# EAGLE design 612_jetracer_328_020017 (EAGLE 9.6.2)
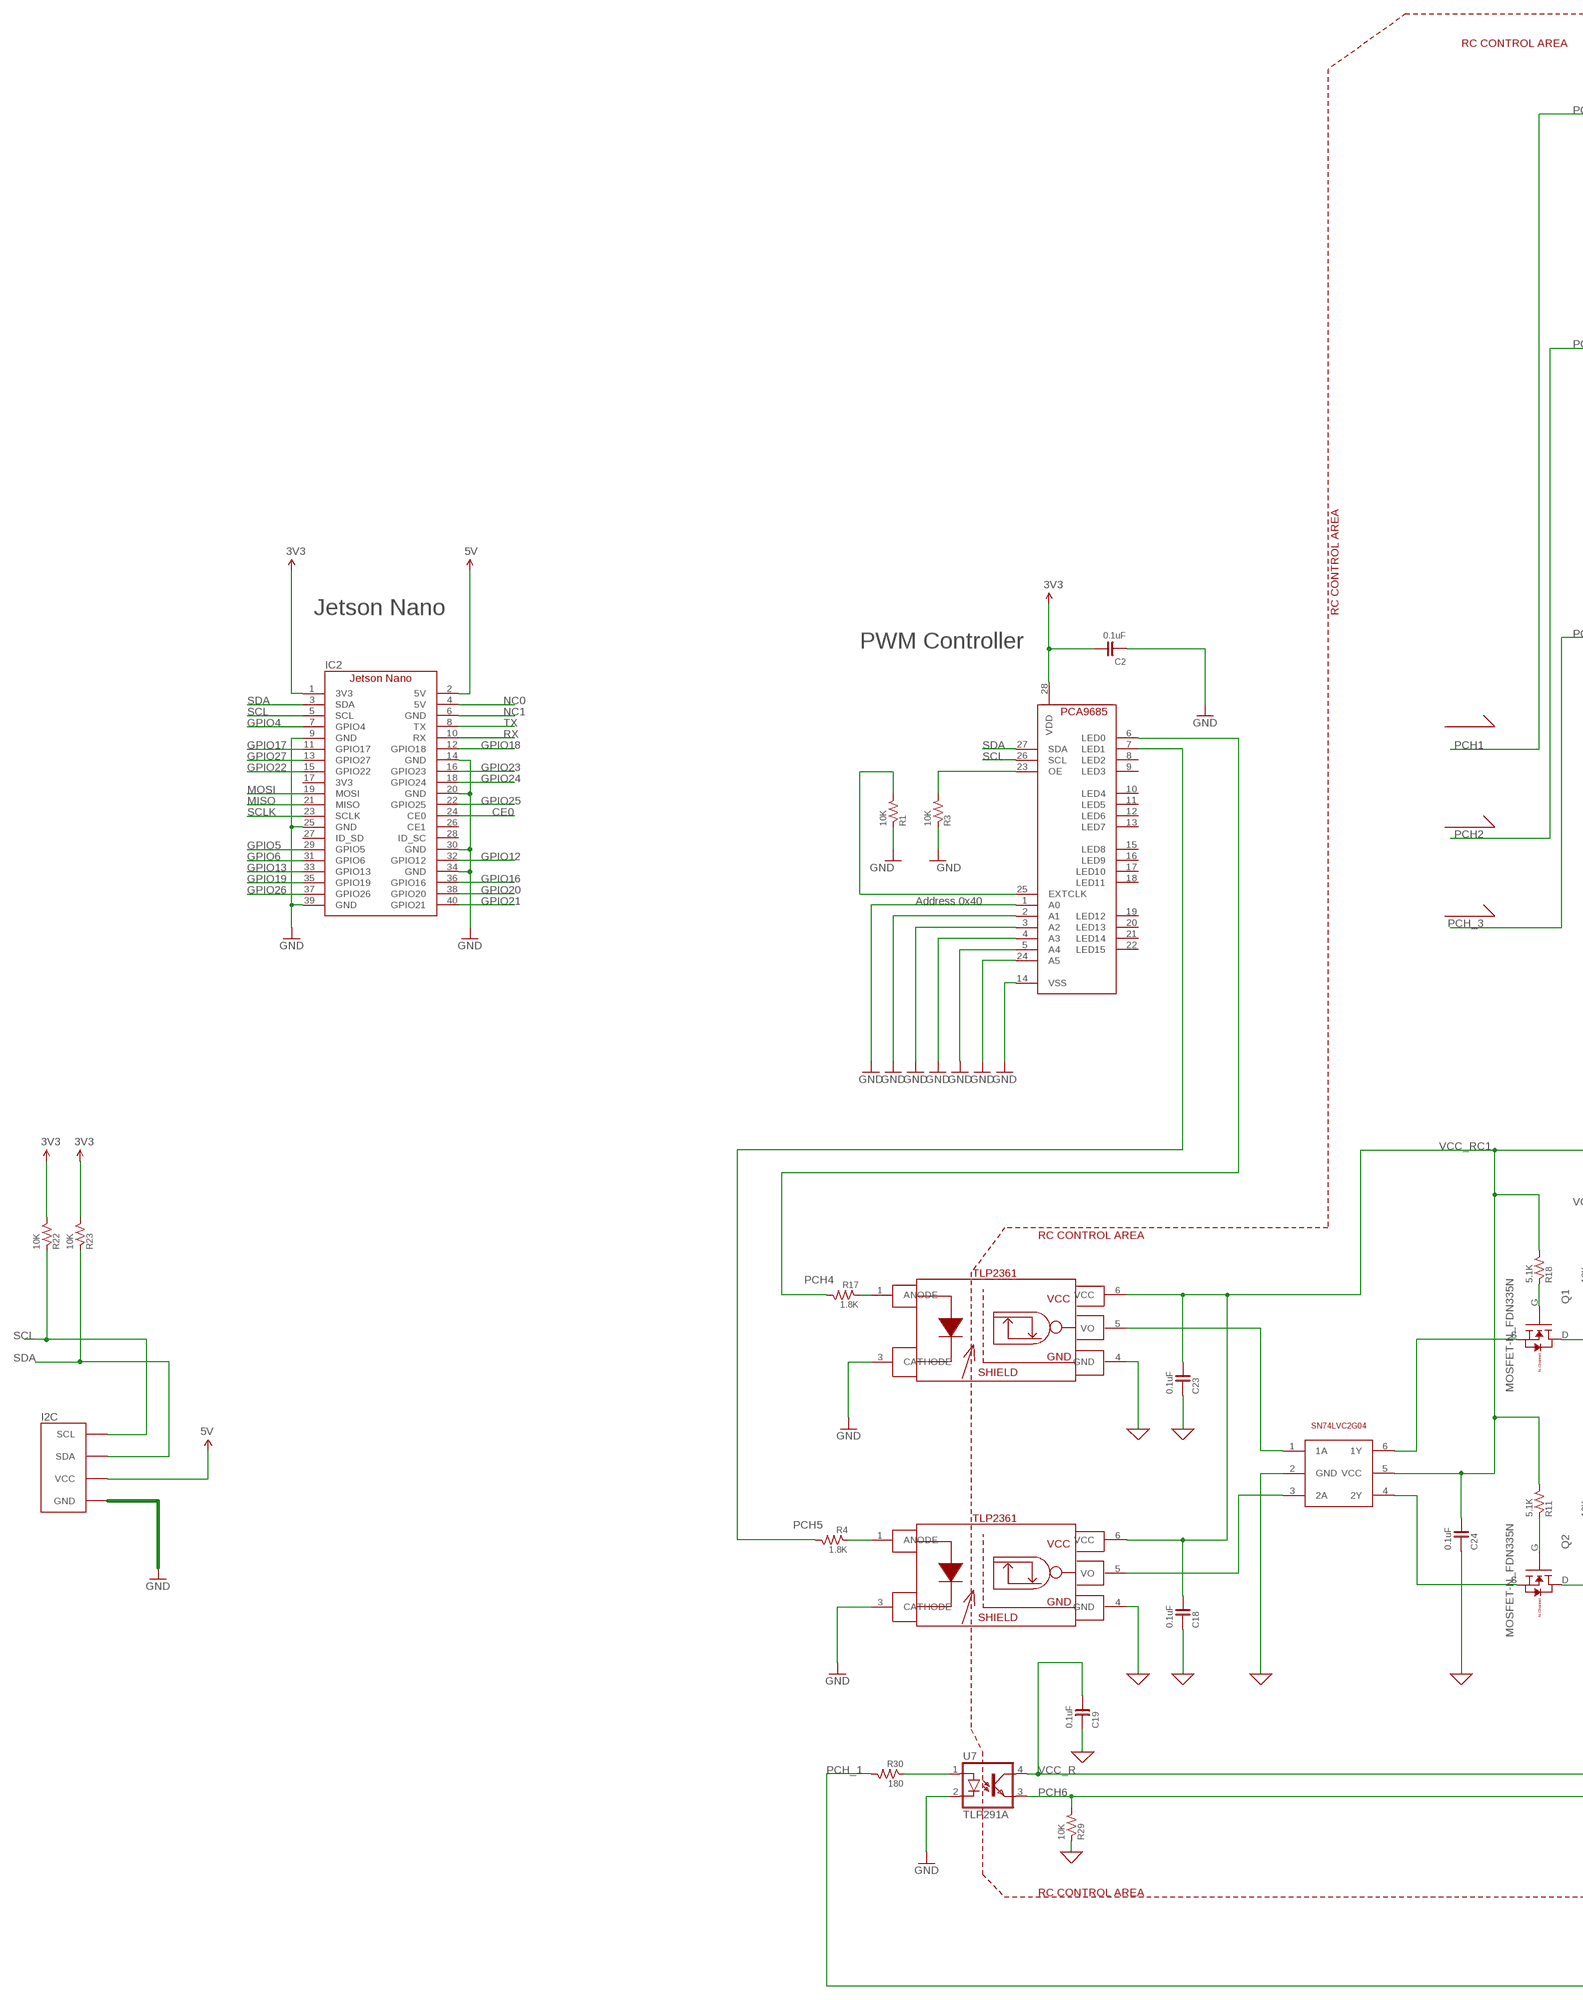
[diagram p0: schematic, sheet 1, part 1 of 3]
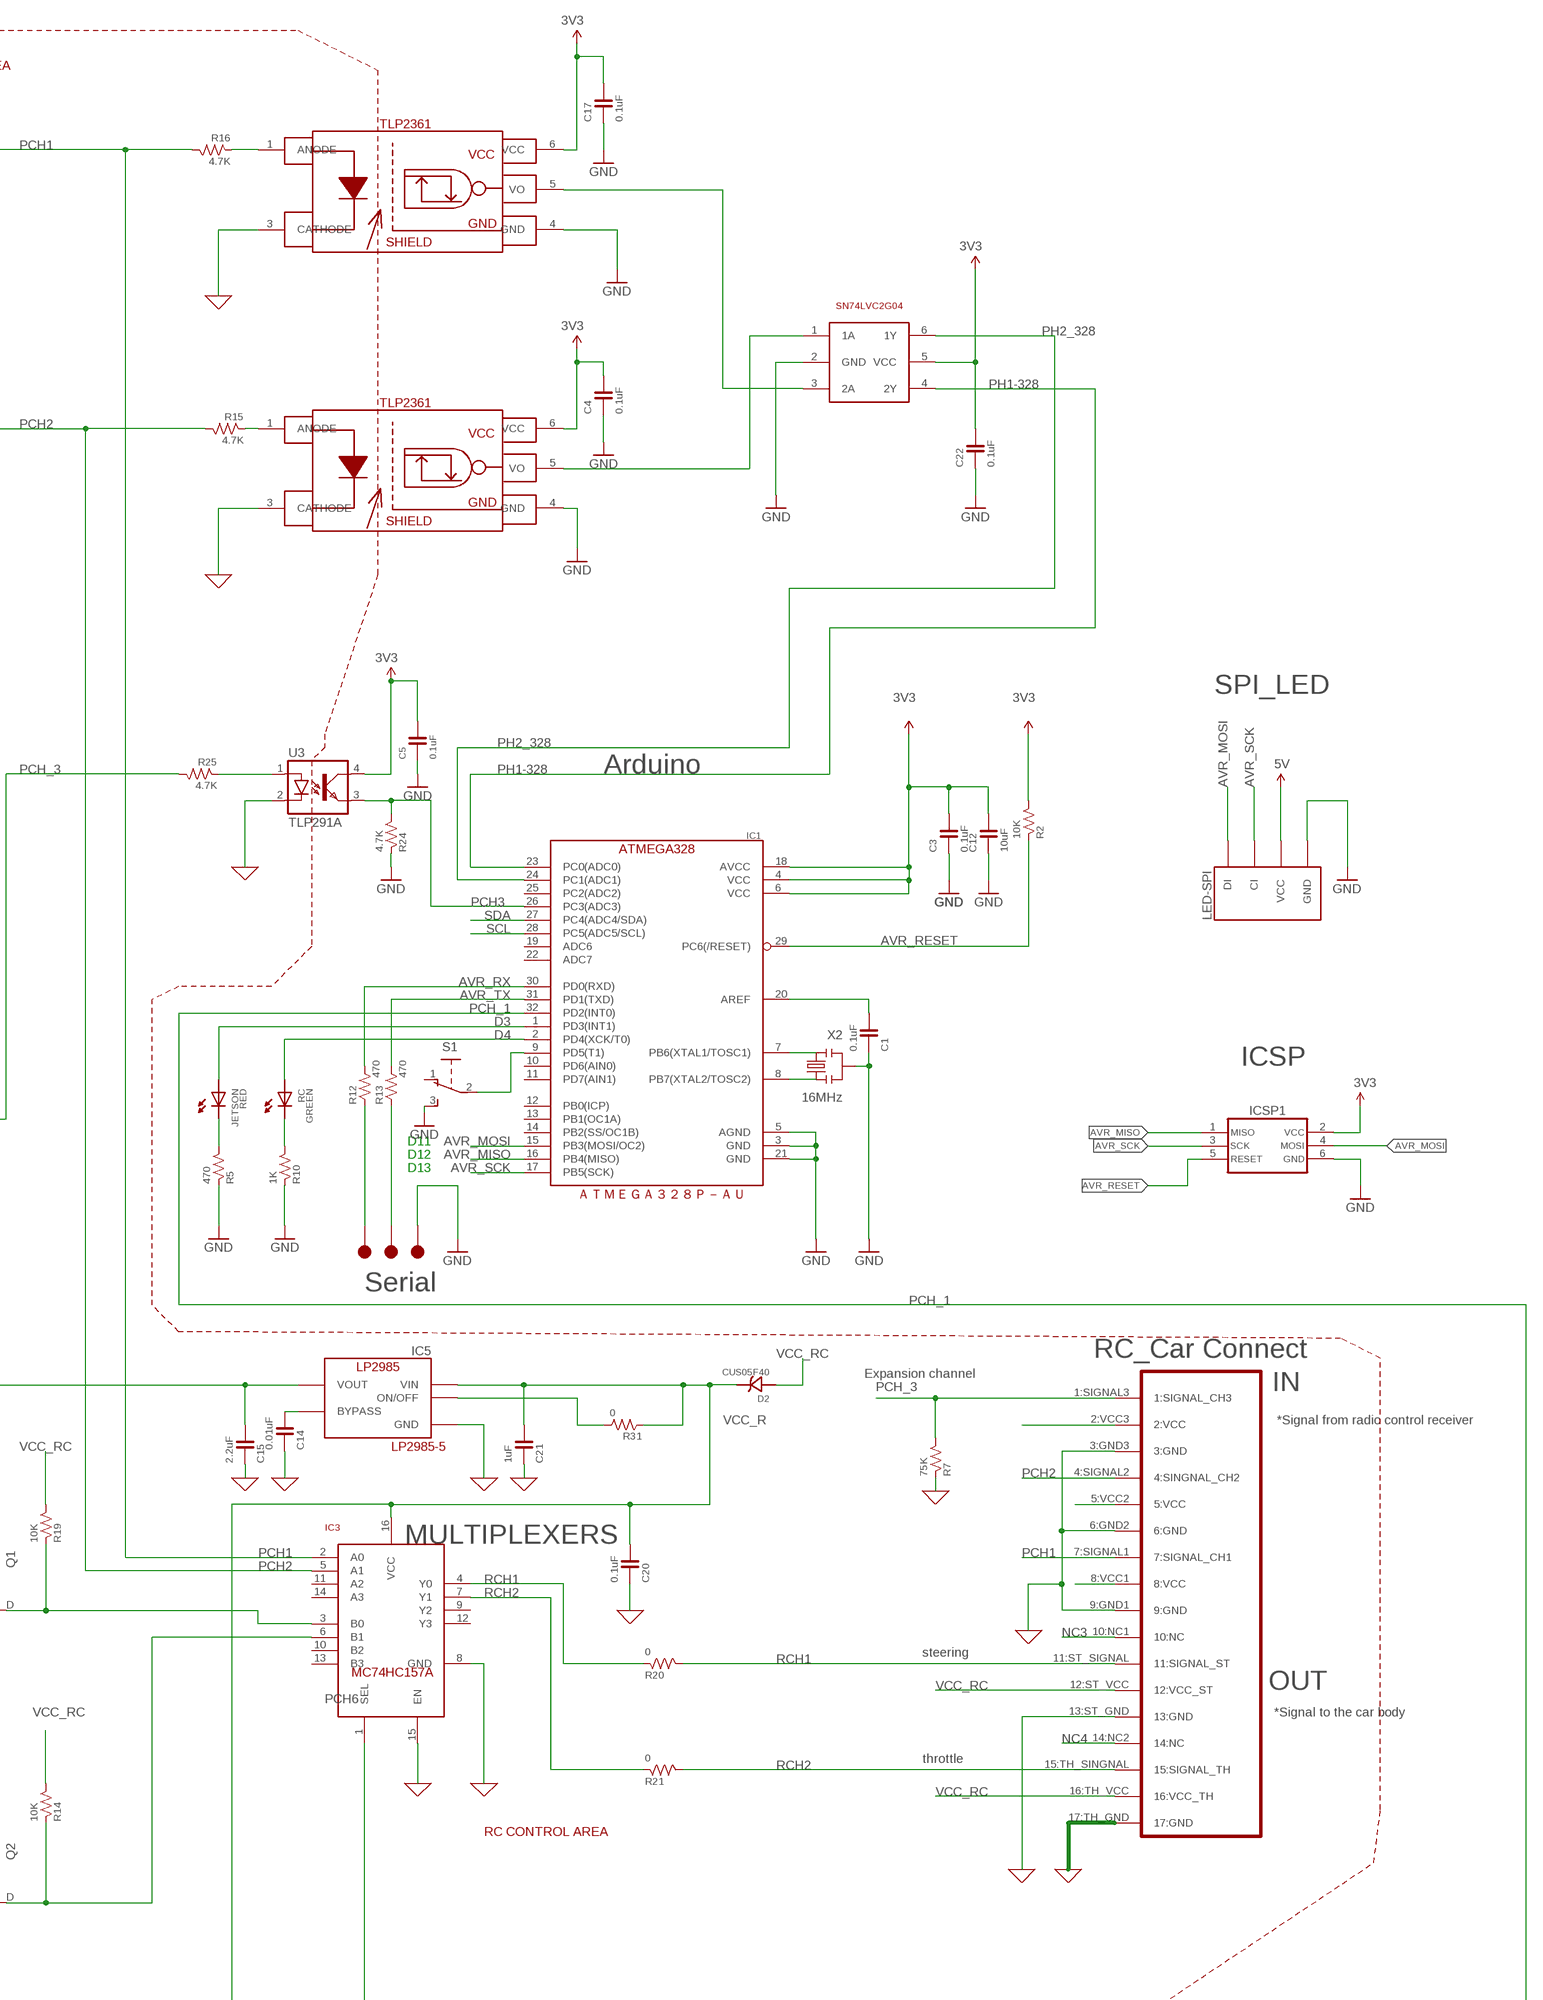
[diagram p1: schematic, sheet 1, part 2 of 3]
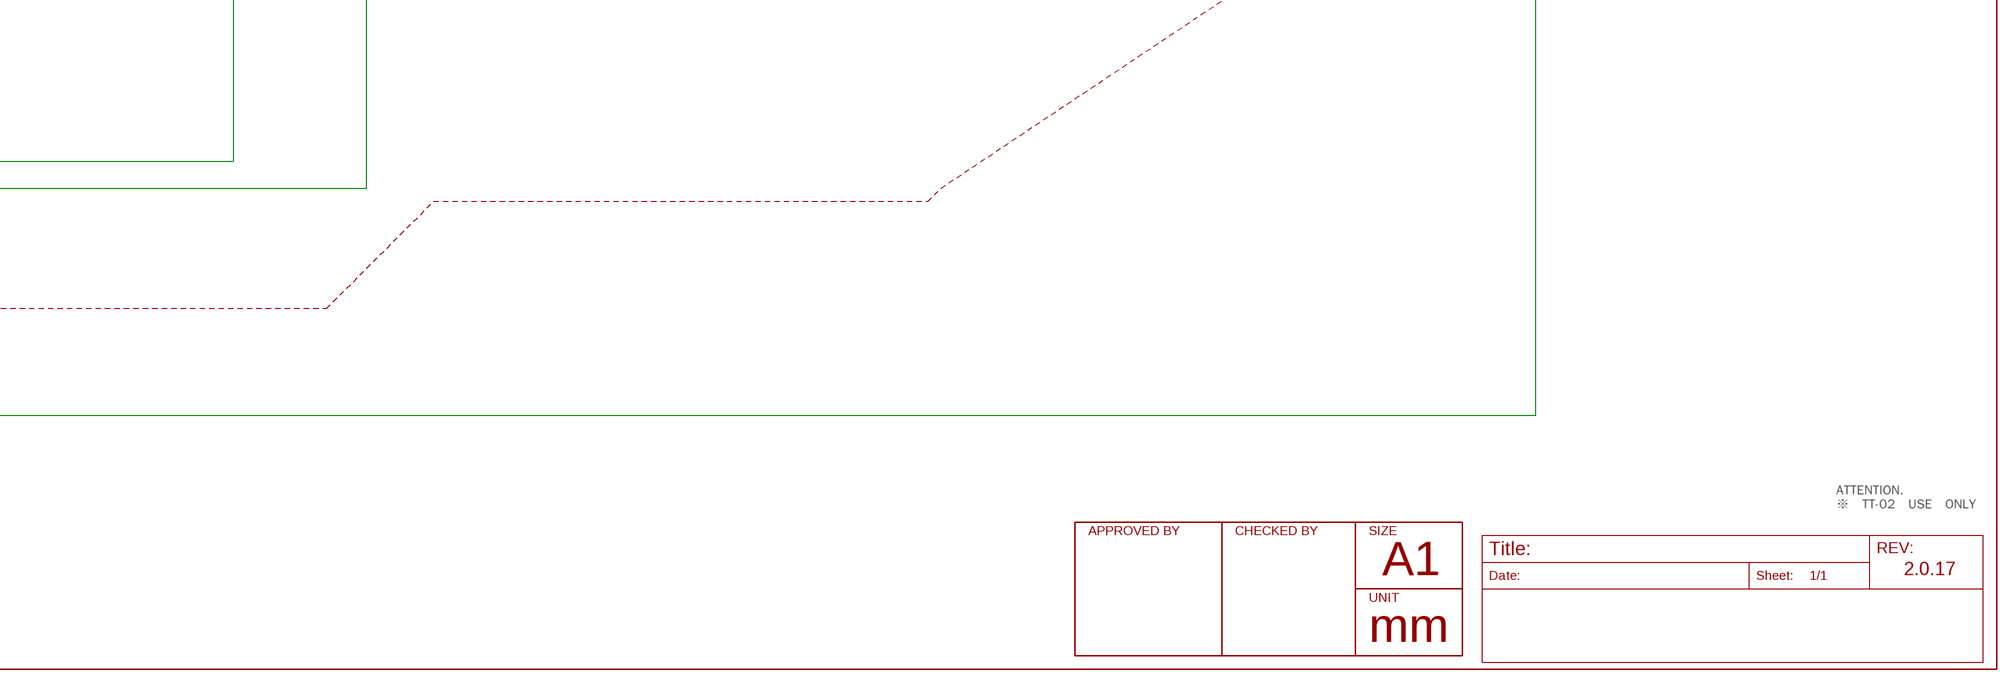
[diagram p2: schematic, sheet 1, part 3 of 3]

## Parts
C1  0.1uF  CAPACITOR-0603  [0603]
C2  0.1uF  CAPACITOR-0603  [0603]
C3  0.1uF  CAPACITOR-0402  [0402]
C4  0.1uF  CAPACITOR-0402  [0402]
C5  0.1uF  CAPACITOR-0603  [0603]
C12  10uF  CAPACITOR-0402  [0402]
C14  0.01uF  CAPACITOR-0603  [0603]
C15  2.2uF  CAPACITOR-0603  [0603]
C17  0.1uF  CAPACITOR-0603  [0603]
C18  0.1uF  CAPACITOR-0603  [0603]
C19  0.1uF  CAPACITOR-0603  [0603]
C20  0.1uF  CAPACITOR-0603  [0603]
C21  1uF  CAPACITOR-0603  [0603]
C22  0.1uF  CAPACITOR-0402  [0402]
C23  0.1uF  CAPACITOR-0603  [0603]
C24  0.1uF  CAPACITOR-0603  [0603]
D2  CUS05F40  [CUS05F40]
I2C  FABO-I2C_BM04B  [I2C-BM04B-PASS-1]
IC1  ATMEGA328P-AU  [TQFP-32]
IC2  JETSON_NANO_NOBORDER  [JETSON_NANO_NOBOARDER]
IC3  MULTIPLEXERSMC74HC157A  [TSSOP-16]
IC4  PCA9685_BOTTOM  [PCA9685_BOTTOM]
IC5  LP2985-33DBV  [SOT-23-5]
ICSP1  ICSP_AVR-TC_NOHOLE  [TC2030]
JETSON  GREEN  LED-0603  [0603]
LED-SPI  FABO-SPI-LED-BM04B  [SPI-BM04B-PASS-1]
Q1  MOSFET-N_FDN335N  [SUPERSOT-3]
Q2  MOSFET-N_FDN335N  [SUPERSOT-3]
R1  10K  RESISTOR-0603  [0603]
R2  10K  RESISTOR-0603  [0603]
R3  10K  RESISTOR-0603  [0603]
R4  1.8K  RESISTOR-0603  [0603]
R5  470  RESISTOR-0603  [0603]
R7  75K  RESISTOR-0603  [0603]
R10  1K  RESISTOR-0603  [0603]
R11  5.1K  RESISTOR-0603  [0603]
R12  470  RESISTOR-0603  [0603]
R13  470  RESISTOR-0603  [0603]
R14  10K  RESISTOR-0603  [0603]
R15  4.7K  RESISTOR-0603  [0603]
R16  4.7K  RESISTOR-0603  [0603]
R17  1.8K  RESISTOR-0603  [0603]
R18  5.1K  RESISTOR-0603  [0603]
R19  10K  RESISTOR-0603  [0603]
R20  0  RESISTOR-0603  [0603]
R21  0  RESISTOR-0603  [0603]
R22  10K  RESISTOR-0603  [0603]
R23  10K  RESISTOR-0603  [0603]
R24  4.7K  RESISTOR-0603  [0603]
R25  4.7K  RESISTOR-0603  [0603]
R29  10K  RESISTOR-0603  [0603]
R30  180  RESISTOR-0603  [0603]
R31  0  RESISTOR-0603  [0603]
RC  RED  LED-0603  [0603]
S1  SLIDE-SSSS810701  [SSSS810701]
T5  SN74LVC2G04  [SOT-23-6]
T6  SN74LVC2G04  [SOT-23-6]
TP1  TP-15  [TP-15]
TP2  TP-15  [TP-15]
TP3  TP-15  [TP-15]
U3  TLP291A  [11-3C1]
U7  TLP291A  [11-3C1]
U8  TLP2361  [TLP2361]
U9  TLP2361  [TLP2361]
U10  TLP2361  [TLP2361]
U11  TLP2361  [TLP2361]
U$1  RC_17PIN_OUTIN  [PNHEADER_2.54_SMT_17PIN_RC_TT01_02]
X2  16MHz  RESONATOR  [CSTNE_V_C]

## Nets
0: C14.1 C15.1 C18.1 C19.1 C20.1 C21.1 C23.1 C24.1 IC3.8(GND) IC3.15(EN) IC5.2(GND) R7.1 R29.1 T6.2(GND) U3.2(C) U8.3(CATHODE) U9.3(CATHODE) U10.4(GND) U11.4(GND) U$1.3:GND3(3:GND) U$1.6:GND2(6:GND) U$1.9:GND1(9:GND) U$1.13:ST_GND(13:GND) U$1.17:TH_GND(17:GND) ; supply symbol labelled GND
3V3: C2.2 C3.2 C4.2 C5.2 C12.2 C17.2 C22.2 IC1.4(VCC) IC1.6(VCC) IC1.18(AVCC) IC2.1(3V3) IC4.28(VDD) ICSP1.2 R2.2 R22.2 R23.2 T5.5(VCC) U3.4(COL) U8.6(VCC) U9.6(VCC)
5V: I2C.5V(VCC) IC2.2(5V) LED-SPI.5V(VCC)
AVR_MISO: IC1.16(PB4(MISO)) ICSP1.1
AVR_MOSI: IC1.15(PB3(MOSI/OC2)) ICSP1.4 LED-SPI.DI
AVR_RESET: IC1.29(PC6(/RESET)) ICSP1.5 R2.1
AVR_RX: IC1.30(PD0(RXD)) R12.2
AVR_SCK: IC1.17(PB5(SCK)) ICSP1.3 LED-SPI.CI
AVR_TX: IC1.31(PD1(TXD)) R13.2
CE0: IC2.24(CE0)
D3: IC1.1(PD3(INT1)) RC.ANODE
D4: IC1.2(PD4(XCK/T0)) JETSON.ANODE
GND: C1.1 C2.1 C3.1 C4.1 C5.1 C12.1 C17.1 C22.1 I2C.GND IC1.3(GND) IC1.5(AGND) IC1.21(GND) IC2.9(GND) IC2.14(GND) IC2.20(GND) IC2.25(GND) IC2.30(GND) IC2.34(GND) IC2.39(GND) IC4.1(A0) IC4.2(A1) IC4.3(A2) IC4.4(A3) IC4.5(A4) IC4.14(VSS) IC4.24(A5) ICSP1.6 LED-SPI.GND R1.1 R3.1 R5.1 R10.1 R24.1 S1.3 T5.2(GND) TP3.1 U7.2(C) U8.4(GND) U9.4(GND) U10.3(CATHODE) U11.3(CATHODE) X2.2
GPIO4: IC2.7(GPIO4)
GPIO5: IC2.29(GPIO5)
GPIO6: IC2.31(GPIO6)
GPIO12: IC2.32(GPIO12)
GPIO13: IC2.33(GPIO13)
GPIO16: IC2.36(GPIO16)
GPIO17: IC2.11(GPIO17)
GPIO18: IC2.12(GPIO18)
GPIO19: IC2.35(GPIO19)
GPIO20: IC2.38(GPIO20)
GPIO21: IC2.40(GPIO21)
GPIO22: IC2.15(GPIO22)
GPIO23: IC2.16(GPIO23)
GPIO24: IC2.18(GPIO24)
GPIO25: IC2.22(GPIO25)
GPIO26: IC2.37(GPIO26)
GPIO27: IC2.13(GPIO27)
MISO: IC2.21(MISO)
MOSI: IC2.19(MOSI)
N$2: R4.1 U11.1(ANODE)
N$3: IC3.3(B0) Q1.D R19.1
N$4: C1.2 IC1.20(AREF)
N$5: IC1.8(PB7(XTAL2/TOSC2)) X2.3
N$6: R12.1 TP1.1
N$7: IC4.23(OE) R3.2
N$8: IC4.25(EXTCLK) R1.2
N$9: R15.1 U9.1(ANODE)
N$10: T5.1(1A) U9.5(VO)
N$11: T5.3(2A) U8.5(VO)
N$12: R16.1 U8.1(ANODE)
N$13: R17.1 U10.1(ANODE)
N$14: T6.1(1A) U10.5(VO)
N$15: IC1.7(PB6(XTAL1/TOSC1)) X2.1
N$16: IC1.9(PD5(T1)) S1.2
N$17: R13.1 TP2.1
N$18: T6.3(2A) U11.5(VO)
N$19: R5.2 RC.CATHODE
N$20: JETSON.CATHODE R10.2
N$31: C14.2 IC5.4(BYPASS)
N$32: IC5.3(ON/OFF) R31.2
N$34: Q2.S T6.4(2Y)
N$35: R21.2 U$1.15:TH_SINGNAL(15:SIGNAL_TH)
N$36: R20.2 U$1.11:ST_SIGNAL(11:SIGNAL_ST)
N$37: Q1.S T6.6(1Y)
N$38: R25.1 U3.1(A)
N$39: Q2.G R11.1
N$40: Q1.G R18.1
N$42: IC3.6(B1) Q2.D R14.1
N$43: R30.1 U7.1(A)
NC0: IC2.4(5V)
NC1: IC2.6(GND)
NC3: U$1.10:NC1(10:NC)
NC4: U$1.14:NC2(14:NC)
PCH1: IC3.2(A0) R16.2 U$1.7:SIGNAL1(7:SIGNAL_CH1)
PCH2: IC3.5(A1) R15.2 U$1.4:SIGNAL2(4:SINGNAL_CH2)
PCH3: IC1.26(PC3(ADC3)) R24.2 U3.3(EMI)
PCH4: IC4.6(LED0) R17.2
PCH5: IC4.7(LED1) R4.2
PCH6: IC3.1(SEL) R29.2 U7.3(EMI)
PCH_1: IC1.32(PD2(INT0)) R30.2
PCH_3: R7.2 R25.2 U$1.1:SIGNAL3(1:SIGNAL_CH3)
PH1-328: IC1.23(PC0(ADC0)) T5.4(2Y)
PH2_328: IC1.24(PC1(ADC1)) T5.6(1Y)
RCH1: IC3.4(Y0) R20.1
RCH2: IC3.7(Y1) R21.1
RX: IC2.10(RX)
SCL: I2C.SCL IC1.28(PC5(ADC5/SCL)) IC2.5(SCL) IC4.26(SCL) R22.1
SCLK: IC2.23(SCLK)
SDA: I2C.SDA IC1.27(PC4(ADC4/SDA)) IC2.3(SDA) IC4.27(SDA) R23.1
TX: IC2.8(TX)
VCC_R: C19.2 C20.2 C21.2 D2.C(CATHODE) IC3.16(VCC) IC5.1(VIN) R31.1 U7.4(COL)
VCC_RC: D2.A(ANODE) R14.2 R19.2 U$1.2:VCC3(2:VCC) U$1.5:VCC2(5:VCC) U$1.8:VCC1(8:VCC) U$1.12:ST_VCC(12:VCC_ST) U$1.16:TH_VCC(16:VCC_TH)
VCC_RC1: C15.2 C18.2 C23.2 C24.2 IC5.5(VOUT) R11.2 R18.2 T6.5(VCC) U10.6(VCC) U11.6(VCC)
Unconnected: IC1.10(PD6(AIN0)) IC1.11(PD7(AIN1)) IC1.12(PB0(ICP)) IC1.13(PB1(OC1A)) IC1.14(PB2(SS/OC1B)) IC1.19(ADC6) IC1.22(ADC7) IC1.25(PC2(ADC2)) IC2.17(3V3) IC2.26(CE1) IC2.27(ID_SD) IC2.28(ID_SC) IC3.9(Y2) IC3.10(B2) IC3.11(A2) IC3.12(Y3) IC3.13(B3) IC3.14(A3) IC4.8(LED2) IC4.9(LED3) IC4.10(LED4) IC4.11(LED5) IC4.12(LED6) IC4.13(LED7) IC4.15(LED8) IC4.16(LED9) IC4.17(LED10) IC4.18(LED11) IC4.19(LED12) IC4.20(LED13) IC4.21(LED14) IC4.22(LED15) S1.1

## Notes on the sheet
- RC CONTROL AREA
- SPI_LED
- Jetson Nano | RC CONTROL AREA
- Arduino
- PWM Controller
- ICSP
- Address 0x40
- D11
- D12
- D13
- ＡＴＭＥＧＡ３２８Ｐ－ＡＵ
- Serial
- RC_Car Connect
- Expansion channel
- IN
- *Signal from radio control receiver
- LP2985-5
- RC CONTROL AREA
- MULTIPLEXERS
- steering
- MC74HC157A
- OUT
- *Signal to the car body
- throttle
- RC CONTROL AREA
- RC CONTROL AREA
- ATTENTION.
  ※　TT-02　USE　ONLY
- 2.0.17

## Library data of the parts
C1-C5 C12 C14 C15 C17 C20-C22 = FaBo-Capacitor:CAPACITOR: CAPACITOR
C18 C19 C23 C24 = FaBo-Capacitor:CAPACITOR: CAPACITOR; SPICEPREFIX: C
D2 = FaBo-Diode:CUS05F40
I2C = FaBo-Connetor:FABO-I2C
IC1 = component:ATMEGA328
IC2 = FaBo-Boards:JETSON_NANO
IC3 = FaBo-Multiplexers:MULTIPLEXERS
IC4 = FaBo-Motor:PCA9685
IC5 = FaBo-Supply:LP2985: LP2985
ICSP1 = component:ICSP_AVR
JETSON RC = FaBo-LED:LED
LED-SPI = FaBo-Connetor:FABO-SPI-LED
Q1 Q2 = FaBo-Mosfet:MOSFET-N
R1-R5 R7 R10-R25 R29-R31 = FaBo-Resistors:RESISTOR: RESISTOR
S1 = FaBo-Switch:SLIDE
T5 T6 = FaBo-Transistor:SN74LVC2G04
TP1-TP3 = FaBo-Supply:TP
U3 U7 = FaBo_Photocoupler:TLP291A
U8-U11 = FaBo-etc:TLP2361
U$1 = FaBo-PIN:RC_17PIN_OUTIN
X2 = component:RESONATOR

## Board
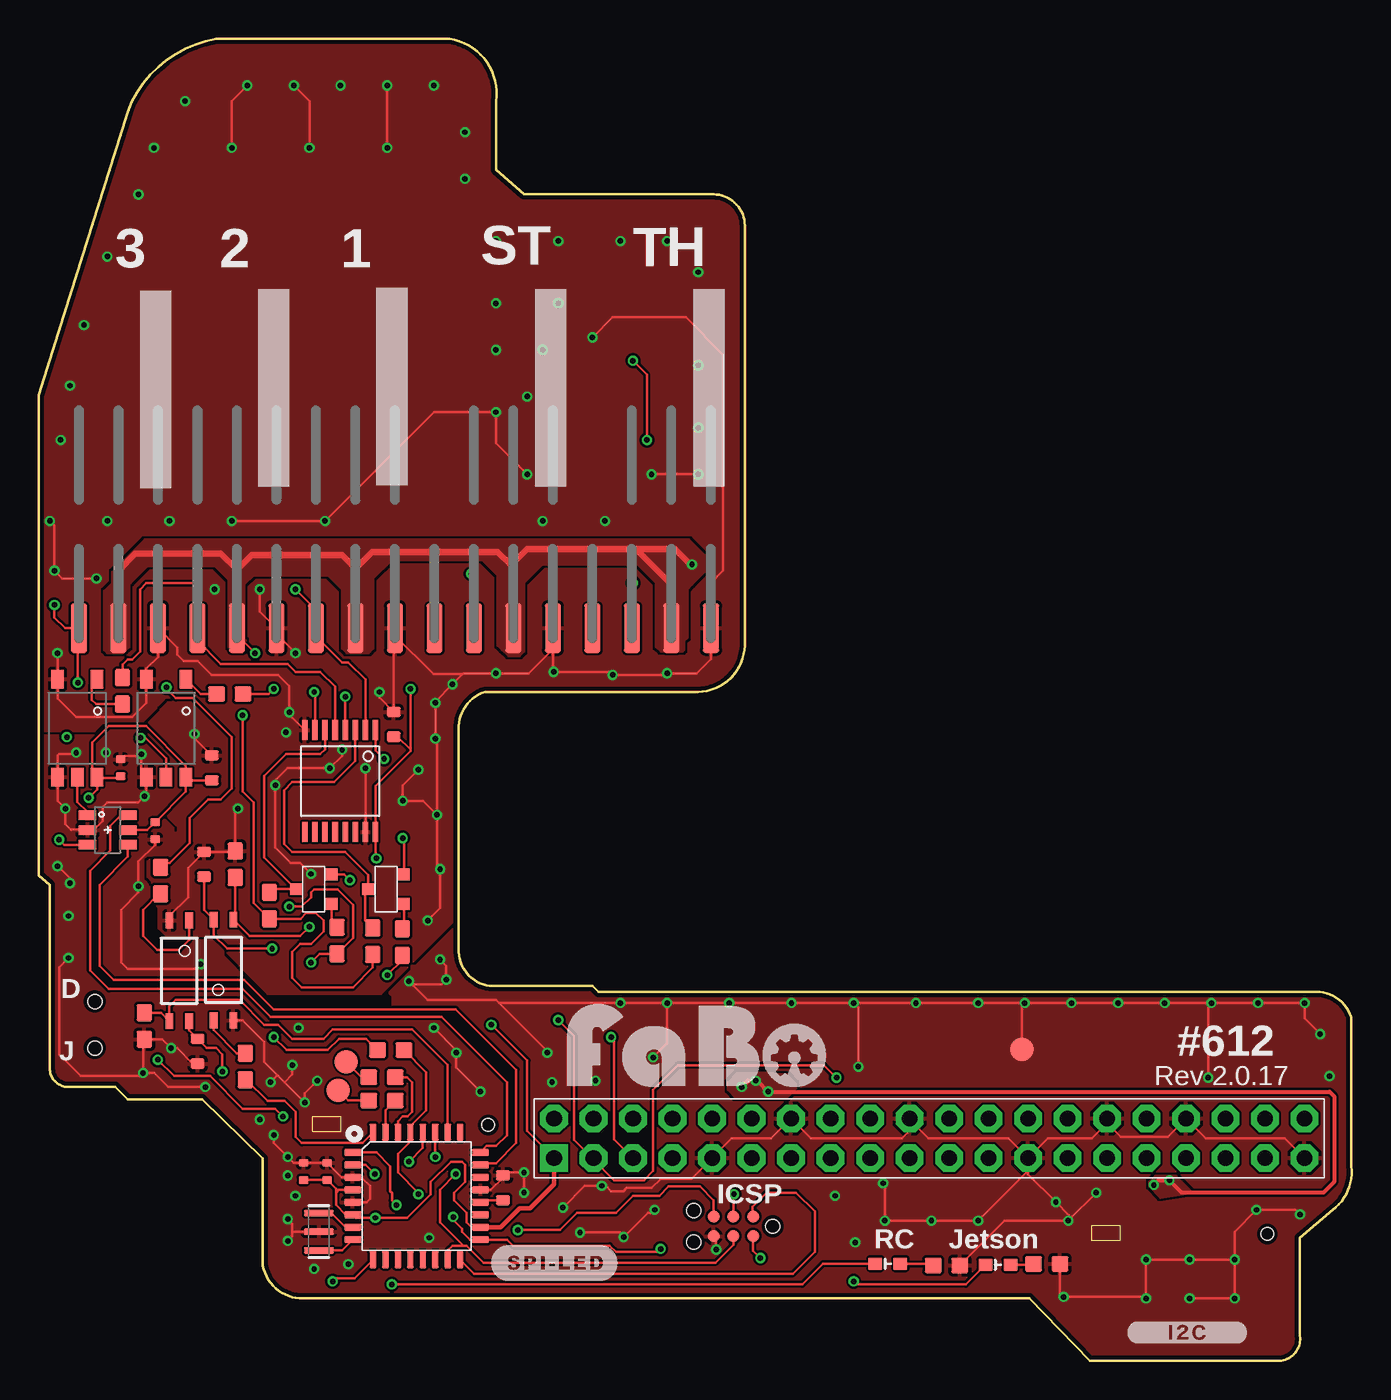
[diagram p3: board, top side]
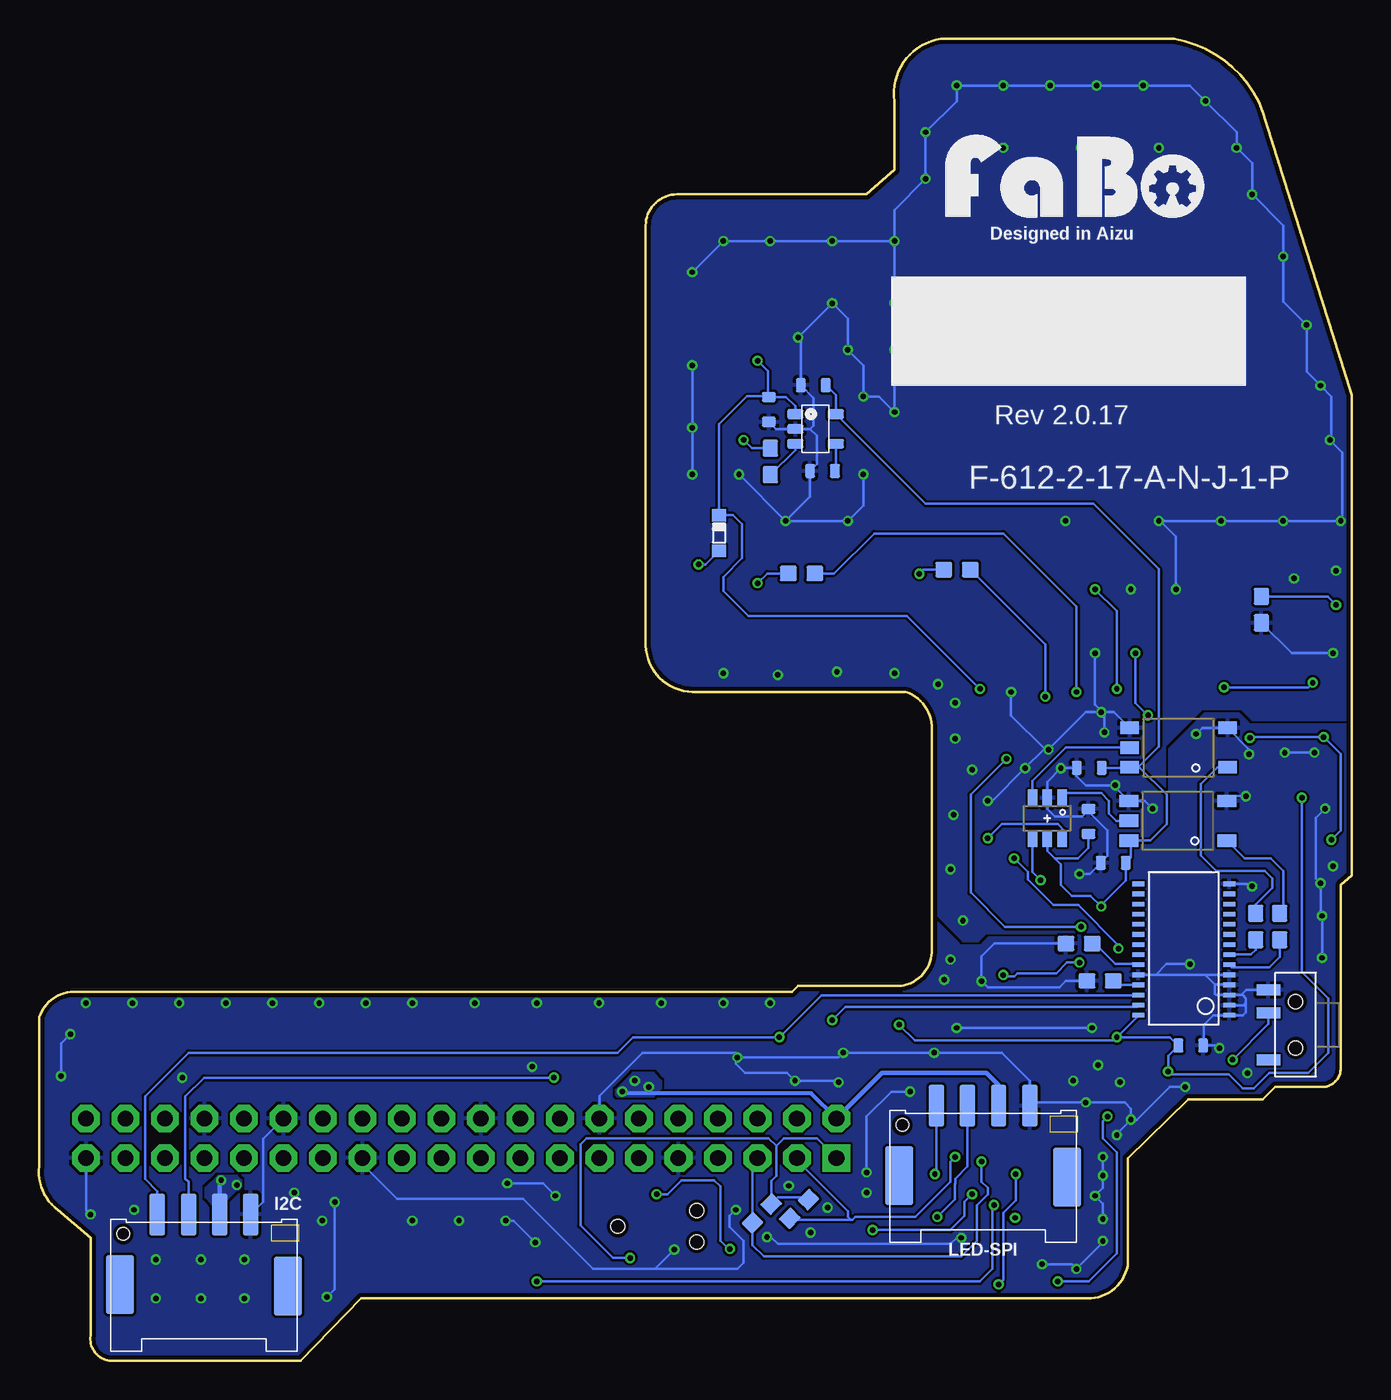
[diagram p4: board, bottom side, seen from below]

Size 84.42 x 85 mm. Coordinates in mm from the lower left corner, seen from the top.
Outline: 0,31.2 0,62.1 5.7,80.3 arc-60 11.4,85 26.4,85 arc-90 29.4,81 29.4,76.6 31.2,75 43.4,75 arc-90 45.4,73 45.4,46 arc-86 42.4,43 28.7,43 arc71 27,40.8 27,26.5 arc85 29,24.1 35.6,24.1 36,23.7 81.9,23.7 arc-78 84.4,22.1 84.4,12.5 arc-61 83.2,9.7 81.1,7.9 81.1,1.6 arc-90 79.9,0 67.6,0 63.7,4 17,4 arc-80 14.4,6.1 14.4,13 10.5,16.8 5.7,16.8 4.9,17.6 1.9,17.6 arc-85 0.7,18.7 0.7,30.6 0,31.2
Copper layers (1*16): Top 0.035mm / dielectric 1.6mm / Bottom 0.035mm
Design rules "PCBway": minimum track width 6mil, minimum drill 12mil, track to track 6mil, track to pad 6mil, pad to pad 6mil, via to via 6mil, smd to smd 6mil, copper to edge 10mil, drill to drill 10mil, minimum pad ring 10mil, minimum via ring 6mil, stop-mask expansion 2mil, vias tented up to drill 100mil, thermal gap 8mil
tKeepout: area 17,14.3 to 19.8,16.1; area 67.2,7.3 to 70,9.1
bKeepout: area 2.6,70.2 to 27.1,91.4
tRestrict: 6 lines

### Footprints (pad centres in the part's own frame; a part is rotated, then mirrored left to right if it is on the bottom)
0603 = smd 0.65 x 0.9: 1 -0.8,0; 2 0.8,0
0402 = smd 0.5 x 0.6: 1 -0.55,0; 2 0.55,0
CUS05F40 = smd 0.8 x 0.9: A -1.15,0; C 1.15,0
I2C-BM04B-PASS-1 = smd 1 x 2.7: 5V -1,0; GND -3,0; SCL 3,0; SDA 1,0 | smd 1.8 x 3.8: P$5 -5.4,4.6; P$6 5.4,4.5 | hole 0.8: 5.2,1.25
TQFP-32 = smd 1.1 x 0.45: 1 -4.1,2.8; 2 -4.1,2; 3 -4.1,1.2; 4 -4.1,0.4; 5 -4.1,-0.4; 6 -4.1,-1.2; 7 -4.1,-2; 8 -4.1,-2.8; 17 4.1,-2.8; 18 4.1,-2; 19 4.1,-1.2; 20 4.1,-0.4; 21 4.1,0.4; 22 4.1,1.2; 23 4.1,2; 24 4.1,2.8 | smd 0.45 x 1.1: 9 -2.8,-4.1; 10 -2,-4.1; 11 -1.2,-4.1; 12 -0.4,-4.1; 13 0.4,-4.1; 14 1.2,-4.1; 15 2,-4.1; 16 2.8,-4.1; 25 2.8,4.1; 26 2,4.1; 27 1.2,4.1; 28 0.4,4.1; 29 -0.4,4.1; 30 -1.2,4.1; 31 -2,4.1; 32 -2.8,4.1
JETSON_NANO_NOBOARDER = drill 1 pad 1.778 square: 1 1.27,1.27 | drill 1 pad 1.778 octagon: 2 1.27,3.81; 3 3.81,1.27; 4 3.81,3.81; 5 6.35,1.27; 6 6.35,3.81; 7 8.89,1.27; 8 8.89,3.81; 9 11.43,1.27; 10 11.43,3.81; 11 13.97,1.27; 12 13.97,3.81; 13 16.51,1.27; 14 16.51,3.81; 15 19.05,1.27; 16 19.05,3.81; 17 21.59,1.27; 18 21.59,3.81; 19 24.13,1.27; 20 24.13,3.81; 21 26.67,1.27; 22 26.67,3.81; 23 29.21,1.27; 24 29.21,3.81; 25 31.75,1.27; 26 31.75,3.81; 27 34.29,1.27; 28 34.29,3.81; 29 36.83,1.27; 30 36.83,3.81; 31 39.37,1.27; 32 39.37,3.81; 33 41.91,1.27; 34 41.91,3.81; 35 44.45,1.27; 36 44.45,3.81; 37 46.99,1.27; 38 46.99,3.81; 39 49.53,1.27; 40 49.53,3.81
TSSOP-16 = smd 0.36 x 1.3: 1 -2.275,-3.28; 2 -1.625,-3.28; 3 -0.975,-3.28; 4 -0.325,-3.28; 5 0.325,-3.28; 6 0.975,-3.28; 7 1.625,-3.28; 8 2.275,-3.28; 9 2.275,3.28; 10 1.625,3.28; 11 0.975,3.28; 12 0.325,3.28; 13 -0.325,3.28; 14 -0.975,3.28; 15 -1.625,3.28; 16 -2.275,3.28
PCA9685_BOTTOM = smd 0.3 x 0.75 bottom: 1 4.3,-2.93; 2 3.65,-2.93; 3 3,-2.93; 4 2.35,-2.93; 5 1.7,-2.93; 6 1.05,-2.93; 7 0.4,-2.93; 8 -0.25,-2.93; 9 -0.9,-2.93; 10 -1.55,-2.93; 11 -2.2,-2.93; 12 -2.85,-2.93; 13 -3.5,-2.93; 14 -4.15,-2.93; 15 -4.15,2.92; 16 -3.5,2.92; 17 -2.85,2.92; 18 -2.2,2.92; 19 -1.55,2.92; 20 -0.9,2.92; 21 -0.25,2.92; 22 0.4,2.92; 23 1.05,2.92; 24 1.7,2.92; 25 2.35,2.92; 26 3,2.92; 27 3.65,2.92; 28 4.3,2.92
SOT-23-5 = smd 0.6 x 1.05: 1 -0.95,-1.3; 2 0,-1.3; 3 0.95,-1.3; 4 0.95,1.3; 5 -0.95,1.3
TC2030 = smd 0.787 x 0.787: 1 1.27,-0.635; 2 1.27,0.635; 3 2.54,-0.635; 4 2.54,0.635; 5 3.81,-0.635; 6 3.81,0.635 | hole 0.889: 0,0; 5.08,-1.016; 5.08,1.016
0603' = smd 0.9 x 0.8: ANODE -0.8,0; CATHODE 0.8,0
SPI-BM04B-PASS-1 = smd 1 x 2.7: 5V -1,-0.1; CI 1,-0.1; DI 3,-0.1; GND -3,-0.1 | smd 1.8 x 3.8: P$5 -5.4,4.5; P$6 5.4,4.4 | hole 0.8: 5.2,1.15
SUPERSOT-3 = smd 0.76 x 0.76: D 0,1.15; G -0.95,-1.15; S 0.95,-1.15
0603'' = smd 1.1 x 1: 1 -0.85,0; 2 0.85,0
SSSS810701 = smd 0.7 x 1.5: 1 -2.25,1.75; 2 0.75,1.75; 3 2.25,1.75 | hole 0.9: -1.5,0; 1.5,0
SOT-23-6 = smd 0.6 x 1.1: 1 -0.95,-1.3; 2 0,-1.3; 3 0.95,-1.3; 4 0.95,1.3; 5 0,1.3; 6 -0.95,1.3
TP-15 = smd 1.5 x 1.5: 1 0,0
11-3C1 = smd 1 x 0.5: 1 -3.24,0.635; 2 -3.24,-0.635; 3 3.24,-0.635; 4 3.24,0.635
TLP2361 = smd 0.8 x 1.2: 1 -1.27,-3.15; 3 1.27,-3.15; 4 1.27,3.15; 5 0,3.15; 6 -1.27,3.15
PNHEADER_2.54_SMT_17PIN_RC_TT01_02 = smd 1.02 x 3.17: 1:SIGNAL3 -20.32,0; 2:VCC3 -17.78,0; 3:GND3 -15.24,0; 4:SIGNAL2 -12.7,0; 5:VCC2 -10.16,0; 6:GND2 -7.62,0; 7:SIGNAL1 -5.08,0; 8:VCC1 -2.54,0; 9:GND1 0,0; 10:NC1 2.54,0; 11:ST_SIGNAL 5.08,0; 12:ST_VCC 7.62,0; 13:ST_GND 10.16,0; 14:NC2 12.7,0; 15:TH_SINGNAL 15.24,0; 16:TH_VCC 17.78,0; 17:TH_GND 20.32,0
CSTNE_V_C = smd 0.4 x 1.9: 1 1.2,0; 2 0,0; 3 -1.2,0

### Placement (x,y rotation side)
C1  29.84,11.12 270 top
C2  10.35,20.27 180 bottom
C3  18.52,12.17 270 top
C4  5.28,38.12 270 top
C5  10.2,19.9 90 top
C12  17.02,12.17 270 top
C14  34.02,57.22 0 bottom
C15  34.62,62.73 0 bottom
C17  11.12,38.12 270 top
C18  16.88,38.12 0 bottom
C19  10.62,31.92 270 top
C20  22.82,40.92 270 top
C21  37.48,61.17 90 bottom
C22  7.47,34.07 90 top
C23  15.32,32.02 0 bottom
C24  16.92,34.67 270 bottom
D2  40.67,53.22 90 bottom
I2C  73.8,9.4 180 bottom
IC1  24.29,10.59 0 top
IC2  31.86,11.77 0 top
IC3  19.38,37.27 180 top
IC4  10.79,26.51 270 top
IC5  34.48,59.92 270 bottom
ICSP1  47.2,8.63 180 top
JETSON  GREEN  [0603']  54.59,6.24 0 top
LED-SPI  23.7,16.3 180 bottom
Q1  22.32,30.32 90 top
Q2  17.68,30.32 90 top
R1  10K  [0603'']  16.18,24.42 0 bottom
R2  10K  [0603'']  22.62,19.97 180 top
R3  10K  [0603'']  17.52,26.82 0 bottom
R4  1.8K  [0603'']  6.17,27.92 270 bottom
R5  470  [0603'']  64.82,6.22 180 top
R7  75K  [0603'']  5.8,48.3 90 bottom
R10  1K  [0603'']  58.37,6.12 180 top
R11  5.1K  [0603'']  19.18,27.02 270 top
R12  470  [0603'']  22.07,18.23 0 top
R13  470  [0603'']  22.07,16.73 0 top
R14  10K  [0603'']  14.82,29.27 270 top
R15  4.7K  [0603'']  5.38,43.07 90 top
R16  4.7K  [0603'']  12.28,42.87 0 top
R17  1.8K  [0603'']  4.62,27.92 270 bottom
R18  5.1K  [0603'']  23.38,26.92 270 top
R19  10K  [0603'']  21.48,26.97 270 top
R20  0  [0603'']  25.38,50.87 180 bottom
R21  0  [0603'']  35.38,50.62 180 bottom
R22  10K  [0603'']  37.92,9.47 45 bottom
R23  10K  [0603'']  35.53,9.75 45 bottom
R24  4.7K  [0603'']  6.78,21.52 90 top
R25  4.7K  [0603'']  7.83,30.87 90 top
R29  10K  [0603'']  12.62,31.92 270 top
R30  180  [0603'']  13.28,18.92 270 top
R31  0  [0603'']  37.38,57.82 270 bottom
RC  RED  [0603']  61.68,6.17 0 top
S1  3.6,21.6 90 bottom
T5  4.42,34.12 270 top
T6  19.57,34.87 180 bottom
TP1  19.77,19.23 90 top
TP2  19.23,17.38 0 top
TP3  63.21,20.02 0 top
U3  9.03,25.07 270 top
U7  11.88,25.12 90 top
U8  8.18,40.67 180 top
U9  2.48,40.67 180 top
U10  11.18,34.72 90 bottom
U11  11.12,39.42 90 bottom
U$1  22.9,47.1 0 top
U$2  [LOGO_FABO_L]  41.6,17.6 0 top
U$3  [LOGO_FABO_L]  18.5,73.5 0 bottom
X2  18.01,8.29 90 top

### Tracks (layer width: path | path; a pad name or v marks a point on that pad's centre or on a via)
0  (via drill 0.35)
  Top 0.152: v35.6,65.8 36.9,67.1 41.6,67.1 44,64.7 44,50.8 43.22,50.02 U$1.17:TH_GND 43.22,45.12 42.3,44.2 v40.4,44.2 40.3,44.1 v36.9,44.1 36.7,44.3 v33.1,44.3 33.06,44.34 33.06,45.76 | v17.5,31.3 16.8,32 16.2,32 15.2,33 v15.2,37 15.2,37.3 16,38.1 v18.7,38.1 19.5,38.9 v19.5,39.3 | U9.3 1.16,43.86 1.2,43.9 | U3.2 8.39,28.59 9.6,29.8 9.6,31.7 C19.1 12.57,32.72 R29.1 12.62,35.33 v12.8,35.5 | v16.5,45.5 15.28,46.72 U$1.6:GND2 14.2,48.18 v14.2,49.6 | U$1.9:GND1 22.82,47.02 22.82,46.7 | 22.82,46.7 C20.1 21.9,42.65 v21.9,43 | U$1.13:ST_GND 33.06,45.76 | IC3.15 v21,38.1 | v12.4,54 v18.4,54 25.4,61 v29.4,61 29.4,59 v31.4,57 | v39.4,57 v42.4,57 | v24.4,38 23.4,37 v23.4,36 24.7,36 v25.6,35.1 | IC3.8 16.1,41.55 v16.1,41.7 16.1,43.4 15.4,44.1 11.1,44.1 10.2,45 9.3,45 8.9,45.4 8.9,45.86 U$1.3:GND3 7.66,45.26 6.91,44.51 U8.3 6.91,42.3 6,41.4 2.4,41.4 1.21,42.59 U9.3 | v0.7,54 1,53.7 v1,50.8 1.5,50.3 v3.7,50.3 | v12.4,78 12.4,81 v13.4,82 | v16.4,82 17.4,81 v17.4,78 | v22.4,82 v22.4,78 | v25.6,35.1 25.6,31.8 v25.8,31.6 25.8,29.1 v25,28.3 | v25.6,35.1 25.6,39.9 v25.5,40 v25.5,42.3 25.5,42.4 v26.6,43.5 27.25,44.15 | 33.06,45.76 31.5,44.2 v29.4,44.2 27.3,44.2 27.25,44.15 | 27.25,44.15 25.38,44.15 22.82,46.7 | U9.3 v1.2,45.5
  Bottom 0.152: 34.82,59.92 IC5.2 37.02,59.92 C21.1 | 34.82,59.92 34.4,59.5 34.4,57.65 C14.1 34.83,55.58 v36.4,54 | 34.82,59.92 34.6,60.14 34.6,61.91 C15.1 35.42,65.62 v35.6,65.8 v33.4,68 32.4,67 v32.4,65 31.4,64 v31.4,62 30.4,62 v29.4,61 v29.4,65 v29.4,68 v29.4,72 | v16.1,41.7 17.1,41.7 v19.5,39.3 19.7,39.3 | U11.4 15.29,41.7 16,41.7 | 16,41.7 v16.1,41.7 | v12.8,35.5 13.29,35.99 U10.4 15.2,36.87 v15.2,37 17.1,37 17.7,37.6 17.7,38.12 C18.1 18.68,38.12 v18.7,38.1 19.57,37.23 T6.2 19.57,35.48 19.1,35 17.32,35 16.92,35.4 | v16.5,45.5 16.5,42.2 16,41.7 | 19.7,39.3 19.8,39.3 v21,38.1 23.1,36 v23.4,36 | 19.7,39.3 21.9,41.5 v21.9,43 | v17.5,31.3 16.84,31.3 C23.1 15.7,32.45 15.7,34.1 16.92,35.32 16.92,35.4 | C24.1 16.92,35.4 | v29.4,72 29.4,74 v27.4,76 v27.4,79 25.4,81 v25.4,82 v22.4,82 v19.4,82 v16.4,82 v13.4,82 10.4,82 v9.4,81 7.4,79 v7.4,78 6.4,77 v6.4,75 4.4,73 v4.4,71 4.4,68.1 v2.9,66.6 2.9,63.6 v2,62.7 1.3,62 1.3,59.3 v1.4,59.2 0.6,58.4 0.6,54.1 v0.7,54 v4.4,54 v8.4,54 12.3,54 | v29.4,72 v33.4,72 v37.4,72 v40.4,72 v42.4,70 | v42.4,64 v42.4,60 v42.4,57 | v39.4,57 v36.4,54 | v36.4,54 v32.4,54 31.4,55 v31.4,57 | 12.3,54 v12.4,54 | v15.9,40.4 15.9,41.5 v16.1,41.7 | v11.3,49.6 11.3,53 12.3,54 | R7.1 3.85,45.5 v1.2,45.5
  pour Top (rank 2): 7.7,29.1 7.7,27.8 8.2,27.3 11,27.3 14.7,23.6 22,23.6 29,30.6 29,35.8 33.8,40.6 45,40.6 48.1,43.7 48.1,77.3 31.3,94.1 2.1,94.1 -3.6,88.4 -3.6,43.8 -0.3,40.5 3.6,40.5 4.1,41 6.6,41 7.6,42 9.7,42 11.9,39.8 11.9,36.9 11.4,36.4 10.4,36.4 9,35 9,33.7 7.8,32.5 7.4,32.5 7,32.1 7,31.1 7.3,30.8 7.3,29.5
  pour Bottom: 15.9,27.5 23.5,27.5 24,27 25,27 28.3,30.3 28.3,35.7 33.5,40.9 44.5,40.9 47.4,43.8 47.4,75.3 30.4,92.3 3.8,92.3 -1.4,87.1 -1.4,42.7 0.1,41.2 6.4,41.2 7.1,41.9 9.6,41.9 12,39.5 12,36.9 11.3,36.2 11.3,33.9 13.9,31.3 14,31.3 14.5,30.8 14.5,26.1 14.7,25.9 15.1,25.9 15.8,26.6 15.8,27.4
3V3  (via drill 0.35)
  Top 0.152: v46.4,6.6 45.93,7.07 ICSP1.2 | 20.18,11 IC1.4 19.29,10.98 19.1,10.8 | v15.1,20.8 15.93,19.97 18.57,19.97 19.3,20.7 21.05,20.7 R2.2 | IC2.1 31.4,14.77 31.4,19.3 v29.1,21.6 | U8.6 9.45,38.26 6.9,40.8 4.5,40.8 3.44,39.74 3.44,37.82 U9.6 | U9.6 3.75,36.74 v3.2,36.2 | U3.4 9.66,21.24 C5.2 10.8,20.1 11.4,20.1 11.8,19.7 v11.8,18.6 | C4.2 5.19,37.48 3.78,37.48 U9.6 | T5.5 6.97,34.12 C22.2 9.45,36.59 U8.6 | C12.2 C3.2 19.1,11.04 19.1,10.8 | U8.6 9.64,37.32 C17.2 | IC1.18 27.82,8.59 27.5,8.9 27.5,9.5 26.7,10.3 26.7,10.8 27.4,11.5 27.4,12.6 27.2,12.8 26.5,12.8 25.2,11.5 25.2,10.7 23.68,9.19 v21.64,9.19 20.39,9.19 IC1.6 19.72,9.38 19.1,10.01 19.1,10.8
  Top 0.305: IC1.18 29.68,8.59 30.9,9.8 31.6,9.8 33.13,11.33 IC2.1
  Bottom 0.152: R23.2 35.07,10.5 36.9,10.5 R22.2 37.32,11.58 37,11.9 37,13.8 | 37,13.8 36.5,14.3 34.4,14.3 IC2.1 | 37,13.8 37.5,14.3 49.2,14.3 49.6,13.9 49.6,8.7 47.5,6.6 v46.4,6.6 | v15.1,20.8 13.71,22.18 IC4.28 | v29.1,21.6 28.1,20.6 15.3,20.6 v15.1,20.8 | v3.2,36.2 3.2,25 1.5,23.3 1.5,19.8 2.8,18.5 5.3,18.5 6.3,17.5 7,17.5 7.9,18.4 11.6,18.4 v11.8,18.6 11.8,19.61 C2.2 11.68,20.8 v15.1,20.8
5V  (via drill 0.35)
  Top 0.254: v71.7,11.3 72,11.6 v72.7,11.6 73.5,10.8 82.6,10.8 83.3,11.5 83.3,17 83,17.3 v46.9,17.3 46.2,18 v46.1,18 45.6,18 v45.2,17.6
  Bottom 0.152: 22.7,17.7 LED-SPI.5V
  Bottom 0.254: IC2.2 34.76,17.2 46.8,17.2 v46.9,17.3
  Bottom 0.305: IC2.2 30.2,18.5 23.5,18.5 22.7,17.7 | I2C.5V 72.8,11.5 v72.7,11.6
  pour Bottom (no thermals): 72.6,10.1 71.7,11 71.6,11 71.4,11.2 71.4,11.6 71.7,11.9 72.9,11.9 73.7,11.1 73.7,10.5 73.3,10.1
  pour Top (no thermals): 72.13,10.47 71.4,11.2 71.4,11.5 71.8,11.9 73.1,11.9 74.22,10.78
  pour Bottom (no thermals): 44.9,17 44.4,17.5 44.4,18 44.9,18.5 45.7,18.5 46.2,18.5 47.3,17.4 47.3,17.1 47.2,17
  pour Top: 44.3,17.4 44.3,17.9 44.9,18.5 47.2,18.5 47.3,18.4 48.1,18.4 48.7,17.8 48.7,17.5 48.1,16.9 44.8,16.9
AVR_MISO
  Top 0.152: IC1.16 27.98,5.6 48.5,5.6 49.9,7 49.9,9.6 48.7,10.8 46.8,10.8 45.9,9.9 45.9,9.3 ICSP1.1
AVR_MOSI  (via drill 0.35)
  Top 0.152: ICSP1.4 44.66,7.46 43.5,6.3 28.6,6.3 27.5,7.4 27.3,7.4 | 27.3,7.4 26.6,7.4 26.29,7.09 IC1.15 | v26.8,12 25.8,11 25.8,8.9 27.3,7.4
  Bottom 0.152: LED-SPI.DI 26.7,12.1 v26.8,12
AVR_RESET  (via drill 0.35)
  Top 0.152: ICSP1.5 43.39,10.31 42.5,11.2 40.5,11.2 39.9,10.6 38.2,10.6 37.1,9.5 34.6,9.5 33.5,8.4 v30.8,8.4 | v24.4,10.7 24.4,10.8 23.1,12.1 23.1,13.3 23.89,14.09 IC1.29 23.89,15.09 24.9,16.1 24.9,18.55 R2.1
  Bottom 0.152: v30.8,8.4 25.8,8.4 24.9,9.3 24.9,10.2 v24.4,10.7
AVR_RX
  Top 0.152: IC1.30 23.09,15.39 23.4,15.7 23.7,15.7 24,16 24,17.9 23.68,18.23 R12.2
AVR_SCK  (via drill 0.35)
  Top 0.152: ICSP1.3 44.66,10.66 v44.7,10.7 | v26.64,9.24 26.64,9.04 27.2,8.49 27.2,8.3 27.71,7.79 IC1.17 30.11,7.79 30.5,7.4 36.7,7.4 37.1,7 39.8,7 v39.98,7.18
  Bottom 0.152: v44.7,10.7 44,10.7 43.1,11.6 41,11.6 40.6,11.2 40.6,7.7 40.09,7.18 v39.98,7.18 | v26.64,9.24 25.5,10.39 25.5,11.37 25.5,11.71 24.7,12.5 LED-SPI.CI
AVR_TX
  Top 0.152: IC1.31 22.29,16.09 R13.2
D3  (via drill 0.35)
  Top 0.152: RC.ANODE 59.62,4.9 52.6,4.9 v52.4,5.1 | v23,10 22.7,10.3 22.7,10.8 22.6,10.9 22.6,12.5 21.71,13.38 IC1.1
  Bottom 0.152: v52.4,5.1 23.9,5.1 23.1,5.9 23.1,9.9 v23,10
D4  (via drill 0.35)
  Top 0.152: JETSON.ANODE 50.44,6.24 49.1,4.9 v22.7,4.9 | v21.6,12 21.02,12.59 IC1.2
  Bottom 0.152: v22.7,4.9 22.4,5.2 22.4,9.5 21.6,10.3 v21.6,12
GND  (via drill 0.35)
  Top 0.152: IC1.21 29.06,10.98 29.84,11.77 C1.1 30.02,12.1 v31.2,12.1 v31.2,10.8 | ICSP1.6 43.56,7.83 v43.56,7.14 | 16.3,8.29 X2.2 | IC1.5 21.09,10.19 21.3,10.4 21.3,11.23 20.8,11.74 20.24,11.74 IC1.3 19.46,11.79 C3.1 C12.1 16.38,12.72 v16,13.1 15.1,14 v15.1,14.5 | v28.4,17.3 26.85,18.85 v26.85,19.8 26.85,19.95 v25.4,21.4 | v6.6,39 6.57,38.97 6.57,38.9 | 6.57,38.9 6.57,37.85 U8.4 6.91,36.41 v6.8,36.3 6.4,35.9 4.4,35.9 4.1,35.6 4.1,34.7 3.6,34.2 | 3.52,34.12 3.6,34.2 | 15.4,18.3 14.5,19.2 14.5,20.5 13.12,21.88 U7.2 | 15.4,18.3 15.8,17.9 | 15.8,17.9 v17.1,16.6 17.1,17.2 v17.9,18 | 55.99,15.5 55.99,14.79 55.5,14.3 49.65,14.3 IC2.14 47.09,14.3 44.55,14.3 IC2.9 41.95,11.7 40,11.7 39.4,11.1 37.8,11.1 37.6,10.9 36.8,10.9 36.46,11.24 v36.2,11.24 35.1,11.24 v33.7,9.84 | 55.99,15.5 IC2.20 | IC2.25 62.34,14.3 57.19,14.3 55.99,15.5 | IC2.25 64.88,14.3 67.7,14.3 68.69,15.29 | 68.69,15.29 IC2.30 | 68.69,15.29 69.58,14.4 72.59,14.4 IC2.34 75.05,14.3 80.12,14.3 IC2.39 | v10.4,25.5 10.1,25.2 5.7,25.2 5.3,25.6 5.3,29 6.4,30.1 v6.4,30.5 6.4,32.1 7.47,33.17 C22.1 | v23.8,24.4 24,24.2 | 24,24.2 25,23.2 29.4,23.2 29.6,23 | 29.6,23 32.7,19.9 v32.7,19.8 | C5.1 9.89,19.1 8.89,20.1 v8.5,20.1 7.93,20.67 R24.1 6.7,20.59 v6.7,18.5 | C4.1 5.5,38.9 6.57,38.9 | C17.1 10,40.05 v10,40.3 | 63.61,12.21 v60.4,9 v57.4,9 v54.4,9 54.4,11.3 v54.3,11.4 | 63.61,12.21 IC2.25 | R10.1 62.09,9 v66.2,9 66.25,9.05 | v82.4,21 81.4,22 v81.4,23 v78.4,23 75.5,23 | 75.5,23 v75.4,23 v72.4,23 v69.4,23 v66.4,23 v63.4,23 | v63.4,23 v60.4,23 v56.4,23 v52.4,23 | v52.4,23 v48.4,23 v44.4,23 v40.4,23 | v40.4,23 v37.4,23 29.6,23 | v40.4,23 40.4,20.4 v39.5,19.5
  Top 0.152: v2.4,39.1 2.3,39 1.3,39 1.21,38.91 U9.4 1.21,35.99 v1.7,35.5 1.7,34.5 2.05,34.15 | v14.9,17.9 15.3,18.3 15.4,18.3 | v16.3,19 16.3,18.4 15.8,17.9 | v37.6,7.94 37.63,7.97 | 37.63,7.97 39.16,9.5 39.6,9.5 v39.6,9.7 | v16,7.7 16.3,8 16.3,8.29 | v16,9.1 16.3,8.8 16.3,8.29 | 2.08,34.12 2.05,34.15 | TP3.1 63.21,22.81 v63.4,23 | v10.7,17.6 8.3,17.6 7.4,18.5 v6.7,18.5 | v6.7,18.5 6.5,18.3 2.7,18.3 1.3,19.7 1.3,25.3 v1.9,25.9 | v1.2,31.8 2,31 v2,30.7 | 66.25,9.05 v68,10.8 | v25.8,25.8 26.2,25.4 v26.2,24.5 25.9,24.2 24,24.2 | 63.61,12.21 63.61,11.99 v65.4,10.2 66.25,9.35 66.25,9.05 | 65.9,6.12 65.8,6.22 R5.1 65.67,4.33 v65.9,4.1 71.1,4.1 v71.2,4 v71.2,6.5 v74,6.5 v76.9,6.5 | v76.9,6.5 v76.9,4 v74,4 | v76.9,6.5 76.9,8.3 v78.3,9.7 80.8,9.7 v81.1,9.4 | v34.8,8.24 37.36,8.24 37.63,7.97 | 2.05,34.15 3.1,34.15 T5.2 3.21,34.2 3.6,34.2 | v52.7,18.9 52.7,22.7 v52.4,23 | v75.2,18.2 75.2,22.7 75.5,23
  Bottom 0.152: v43.56,7.14 44.8,5.9 | 44.8,5.9 48.8,5.9 53.3,10.4 61.4,10.4 63.61,12.61 IC2.25 | IC2.14 48.37,17.03 45.6,19.8 39.6,19.8 39.6,19.5 | 39.6,19.5 v39.5,19.5 33,19.5 v32.7,19.8 v26.85,19.8 22.5,19.8 20.7,18 LED-SPI.GND 20.5,16.6 v17.1,16.6 14.6,16.6 14.2,16.2 v14.2,15.5 | v31.2,12.1 31.2,15.7 29.6,17.3 v28.4,17.3 | v10,40.3 9.61,40.69 U11.3 6.6,39.31 v6.6,39 | v6.8,36.3 7.71,36.3 U10.3 | 12.6,24.81 9.3,24.81 | 9.3,24.81 IC4.5 | IC4.4 7.91,24.2 8.8,24.2 | 8.8,24.2 9.3,24.7 9.3,24.81 | 8.8,24.2 8.8,23.6 8.71,23.51 IC4.3 7.1,23.51 | IC4.2 6.94,22.86 6.8,23 | 6.8,23 6.8,23.3 7.01,23.51 7.1,23.51 | 6.8,23 6.8,22.4 7,22.2 7.01,22.21 IC4.1 8.89,22.21 9.5,21.6 9.5,20.27 | C2.1 9.5,20.27 | 9.5,20.27 8.66,20.27 v8.5,20.1 | R1.1 18.38,24.42 18.8,24 23.4,24 v23.8,24.4 23.8,26 22.98,26.82 R3.1 | IC4.14 6.56,30.66 v6.4,30.5 | v10.4,25.5 11.91,25.5 12.6,24.81 | v1.9,25.9 v1.9,28.6 2,28.7 v2,30.7 2.3,31 2.3,34.9 v1.7,35.5 | v33,17.9 33.1,18 v35.8,18 36.3,18.5 39,18.5 39.6,19.1 39.6,19.5 | v2.4,39.1 v4.3,39.1 | v16.7,21.4 v25.4,21.4 | v25.1,7.9 25.4,7.9 25.8,7.5 36.9,7.5 37.34,7.94 v37.6,7.94 | IC2.30 70,14.27 70,10.2 I2C.GND | IC4.24 12.6,24.81 | v14.2,15.5 13.8,15.5 11.7,17.6 v10.7,17.6 | 44.8,5.9 39.5,5.9 39.1,6.3 39.1,7.7 40,8.6 40,9.3 v39.6,9.7 | v51.2,10.6 52,11.4 v54.3,11.4 | v52.5,7.6 53.9,9 v54.4,9 | S1.3 6.76,23.85 7.1,23.51 | v14.2,15.5 15.1,14.6 v15.1,14.5 | v19.9,6.2 18,6.2 v17.7,5.9 16,7.6 v16,7.7 | v16,9.1 16,10.1 v16.5,10.6 16,11.1 v16,11.9 v16,13.1 | IC2.39 81.39,9.69 v81.1,9.4 | v65.9,4.1 65.4,4.6 v65.4,10.2 | v83,18.3 83,20.4 v82.4,21
  pour Top (rank 3): -8.92,100.72 123.22,100.72 123.22,-1.57 -8.92,-1.57
  pour Bottom (rank 3): -7.58,100.17 125.07,100.17 125.07,-0.07 -7.58,-0.07
N$2
  Bottom 0.152: U11.1 8.65,38.15 9.7,37.1 9.7,32.5 8.7,31.5 5.6,31.5 5.1,31 5.1,30.4 6.17,29.32 R4.1
N$3
  Top 0.152: IC3.3 20.35,38.55 19,37.2 16.3,37.2 15.78,36.67 15.78,33.23 16.3,32.7 19.7,32.7 21.18,31.23 Q1.D 20.98,30.12 20.98,28.32 R19.1
N$4
  Top 0.152: IC1.20 28.52,10.31 C1.2
N$5
  Top 0.152: IC1.8 19.5,7.09 X2.3
N$6
  Top 0.152: R12.1 20.77,18.23 TP1.1
N$7
  Bottom 0.152: IC4.23 13.76,25.5 15.2,25.5 16.52,26.82 R3.2
N$8
  Bottom 0.152: R1.2 15.06,24.16 IC4.25
N$9
  Top 0.152: R15.1 3.68,42.22 3.4,42.5 3.4,43.48 U9.1
N$10
  Top 0.152: T5.1 3.12,35.27 2.48,35.92 U9.5
N$11  (via drill 0.35)
  Top 0.152: U8.5 8.18,38.73 6.8,40.1 6.74,40.04 v6.54,40.04 | T5.3 1.63,33.17 v1.3,33.5
  Bottom 0.152: v6.54,40.04 6.49,40.1 v1.8,40.1 0.7,39 0.7,34.1 v1.3,33.5
N$12
  Top 0.152: U8.1 10.39,42.87 R16.1
N$13
  Bottom 0.152: R17.1 4.4,28.77 4.4,31.5 5.2,32.3 6.88,32.3 U10.1
N$14
  Bottom 0.152: T6.1 18.3,36.5 16.1,36.5 15.6,36 15.6,35.2 15.12,34.72 U10.5
N$15
  Top 0.152: IC1.7 19.71,8.59 18.8,9.5 18.8,9.4 18.1,9.4 X2.1
N$16  (via drill 0.35)
  Top 0.152: IC1.9 20.29,5.29 19.09,5.29 v18.9,5.1 | v7.65,19.35 8.7,18.3 11,18.3 13.1,16.2 15.2,16.2 v15.7,15.7
  Bottom 0.152: v18.9,5.1 16.9,5.1 15.1,6.9 15.1,13.4 16,14.3 16,15.4 v15.7,15.7 | S1.2 5.35,21.65 v7.65,19.35
N$17
  Top 0.152: R13.1 19.88,16.73 TP2.1
N$18
  Bottom 0.152: U11.5 18.38,39.42 20.52,37.27 T6.3
N$19
  Top 0.152: RC.CATHODE 63.91,6.17 R5.2
N$20
  Top 0.152: JETSON.CATHODE 57.41,6.24 R10.2
N$31
  Bottom 0.152: C14.2 33.17,57.27 IC5.4
N$32
  Bottom 0.152: R31.2 35.77,58.57 IC5.3
N$34  (via drill 0.35)
  Top 0.152: Q2.S 19.63,31.27 v20,30.9
  Bottom 0.152: v20,30.9 20.52,31.43 T6.4
N$35  (via drill 0.35)
  Top 0.152: U$1.15:TH_SINGNAL 38.14,49.94 v38.2,50
  Bottom 0.152: v38.2,50 37.58,50.62 R21.2
N$36  (via drill 0.35)
  Top 0.152: U$1.11:ST_SIGNAL 27.98,50.42 v27.8,50.6
  Bottom 0.152: v27.8,50.6 27.53,50.87 R20.2
N$37  (via drill 0.35)
  Top 0.152: Q1.S 23.48,33.52 v23.4,33.6
  Bottom 0.152: v23.4,33.6 22.5,34.5 18.9,34.5 18.5,34.1 18.5,33.7 T6.6
N$38
  Top 0.152: U3.1 9.66,27.06 9,26.4 7.6,26.4 6.7,27.3 6.7,29 7.72,30.02 R25.1
N$39
  Top 0.152: R11.1 18.82,28.22 Q2.G
N$40
  Top 0.152: Q1.G 23.48,27.87 R18.1
N$42
  Top 0.152: IC3.6 18.4,39.3 18.1,39 15.9,39 14.5,37.6 14.5,32.34 Q2.D 15.03,30.32 R14.1
N$43
  Top 0.152: R30.1 12.73,19.77 11.24,21.26 U7.1
PCH1  (via drill 0.35)
  Top 0.152: IC3.2 21,43.8 19.9,44.9 19.5,44.9 17.82,46.58 U$1.7:SIGNAL1 17.82,48.28 v16.5,49.6 | R16.2 14.77,42.87 v15.1,43.2
  Bottom 0.152: v15.1,43.2 15.1,48.2 v16.5,49.6
PCH2
  Top 0.152: IC3.5 19.05,43.35 18.1,44.3 16.5,44.3 16,44.8 11.7,44.8 10.2,46.3 U$1.4:SIGNAL2 10.2,49.7 9.9,50 6.9,50 6.5,49.6 6.5,45.6 6,45.1 5.7,45.1 5.38,44.77 R15.2
PCH3
  Top 0.152: IC1.26 26.29,19.01 24,21.3 18.9,21.3 18.3,20.7 16.3,20.7 15.4,21.6 14.5,21.6 12.9,23.2 8.8,23.2 8.39,22.79 U3.3 7.85,22.37 R24.2
PCH4
  Bottom 0.152: R17.2 4.62,25.98 5.3,25.3 7.71,25.3 IC4.6
PCH5
  Bottom 0.152: R4.2 6.17,26.43 6.49,26.11 IC4.7
PCH6  (via drill 0.35)
  Top 0.152: R29.2 12.62,28.48 U7.3 13.57,27.3 16.8,27.3 v17.4,27.9 | IC3.1 21.65,39.25 v22.2,38.7
  Bottom 0.152: v22.2,38.7 24.5,36.4 24.5,30.1 22.3,27.9 v17.4,27.9
PCH_1
  Top 0.152: R30.2 13.33,18.07 14.7,16.7 15.8,16.7 16.5,16 16.5,14.4 16.9,14 20.8,14 IC1.32
PCH_3  (via drill 0.35)
  Top 0.152: R25.2 8.11,32 8.4,32 9.7,33.3 9.7,34.9 10.9,36.1 11.7,36.1 12.4,36.8 12.4,40.1 9.9,42.6 8.8,42.6 8.2,43.2 v8.2,43.3 | v1,48.6 1,47.8 1.7,47.1 U$1.1:SIGNAL3 2.5,47.02 v2.5,43.6
  Bottom 0.152: v8.2,43.3 2.8,43.3 v2.5,43.6 | v1,48.6 1.55,49.15 R7.2
PH1-328
  Top 0.152: IC1.23 28.5,12.7 29.4,12.7 30.7,14 30.7,18.7 26.8,22.6 15.1,22.6 13.2,24.5 4.8,24.5 3.9,25.4 3.9,30.6 5.72,32.42 T5.4
PH2_328
  Top 0.152: IC1.24 28.8,13.8 29.4,13.8 30.1,14.5 30.1,17.9 25.9,22.1 14.9,22.1 13.1,23.9 4.5,23.9 3.3,25.1 3.3,31.5 4.6,32.8 4.6,34.4 5.27,35.07 T5.6
RCH1  (via drill 0.35)
  Top 0.152: v19.7,42.7 IC3.4
  Bottom 0.152: R20.1 19.7,46.05 v19.7,42.7
RCH2  (via drill 0.35)
  Top 0.152: v17.7,43 17.75,42.95 IC3.7
  Bottom 0.152: R21.1 33.28,50.62 30.7,53.2 22.4,53.2 17.7,48.5 v17.7,43
SCL  (via drill 0.35)
  Top 0.152: v23.8,12.8 24.69,13.69 IC1.28 | IC2.5 37,14.24 37,20.6 v36.8,20.8
  Bottom 0.152: IC2.5 38.21,12.72 38.53,12.4 R22.1 38.53,7.43 37.8,6.7 25.1,6.7 24.1,7.7 24.1,10 23.4,10.7 23.4,11.1 23.8,11.5 v23.8,12.8 | IC4.26 13.72,23.5 34.1,23.5 v36.8,20.8 46.2,20.8 47.2,19.8 74.8,19.8 77.6,17 77.6,11.7 76.8,10.9 I2C.SCL
SDA  (via drill 0.35)
  Top 0.152: v25.5,13.1 v25.49,13.11 IC1.27 | v33.4,21.9 34.4,20.9 34.4,14.2 35.56,13.04 35.6,13.04 | 35.6,13.04 IC2.3 | v51.3,18.2 50.5,19 41.1,19 39.5,17.4 39.5,12.2 38.9,11.6 37,11.6 35.6,13 35.6,13.04
  Bottom 0.152: v25.5,13.1 25.8,12.8 25.8,11.5 28.05,9.25 31.9,9.25 32.1,9.05 32.2,9.05 | IC2.3 35.67,12.87 32.4,9.6 32.4,9.25 32.2,9.05 | IC4.27 13.81,22.76 32.54,22.76 v33.4,21.9 | 32.2,9.05 36.03,9.05 R23.1 | v51.3,18.2 73.8,18.2 75,17 75,11.7 74.8,11.5 I2C.SDA
VCC_R  (via drill 0.35)
  Top 0.152: v39.1,59.2 39.1,63.4 v38.2,64.3 | 23.9,39.3 23.9,39.2 21.65,36.95 IC3.16 21.65,32.35 v21.7,32.3 | 23.9,39.3 v23.9,43.2 | v15,26.5 12.1,26.5 11.24,27.36 U7.4 10.62,28.98 C19.2 | C20.2 23.08,40.12 23.9,39.3
  Bottom 0.152: R31.1 38.57,58.67 v39.1,59.2 | v23.9,43.2 28.6,47.9 38.8,47.9 40.4,49.5 40.4,50.4 39.2,51.6 39.2,53.8 39.77,54.37 D2.C 40.67,60.23 38.88,62.02 37.52,62.02 | v21.7,32.3 20.83,31.43 20.83,30.94 19.19,29.3 17.59,29.3 15,26.71 v15,26.5 | IC5.1 35.77,61.38 36.37,61.97 C21.2 37.52,62.02 | 37.52,62.02 37.52,63.62 v38.2,64.3
VCC_RC  (via drill 0.35)
  Top 0.152: v42,51.2 42,51.1 | R19.2 21.48,25.27 20.2,24 16.9,24 16.3,24.6 16.3,26.3 16.8,26.8 17.5,26.8 18.3,27.6 18.3,28.3 17.8,28.8 17.2,28.8 16.82,28.42 R14.2 13.8,29.45 13.8,35.9 13.1,36.6 v13.1,41.5 | U$1.5:VCC2 12.74,47 12.74,46.66 v13.9,45.5
  Top 0.305: 40.68,49.92 U$1.16:TH_VCC
  Top 0.406: U$1.2:VCC3 5.12,50.82 6.2,51.9 11.7,51.9 12.74,50.86 | 12.74,47 12.74,50.86 | 12.74,50.86 13.68,51.8 19.5,51.8 20.36,50.94 | U$1.8:VCC1 20.36,50.94 | 20.36,50.94 21.42,52 29.5,52 30.35,51.15 | U$1.12:ST_VCC 30.52,50.98 30.35,51.15 | 30.35,51.15 31.4,52.2 38.4,52.2 | 42,51.1 40.9,52.2 38.4,52.2 | 38.4,52.2 40.68,49.92
  Bottom 0.152: D2.A 41.55,51.2 v42,51.2 | v13.9,45.5 13.9,42.3 v13.1,41.5
  pour Top (no thermals): 4.2,45.7 4.2,49.5 4.7,50 4.7,50.7 4.9,50.9 6.8,52.8 41.5,52.8 41.8,52.8 42.9,51.7 42.9,50.8 42,49.9 41.7,49.6 41.7,46.5 41.5,46.3 41.5,45.7 41.4,45.6 40,45.6 39.7,45.9 39.7,50 38.5,51.2 32.4,51.2 31.2,50 31.2,45.6 30.9,45.3 30.3,45.3 30.2,45.3 29.8,45.7 29.5,46 29.5,50.5 28.5,51.5 22.7,51.5 21.5,50.3 21.5,46.4 21.5,45.8 21.3,45.6 21.2,45.5 19.8,45.5 19.5,45.8 19.5,49.6 18.6,50.5 14,50.5 13.8,50.5 13.2,49.9 13.2,46.4 13.3,46.3 12.7,45.7 12.4,45.7 12.2,45.9 12.2,50.2 11.3,51.1 8,51.1 7,51.1 5.9,50 5.8,49.9 5.8,45.9 5.4,45.5 5.3,45.5 4.4,45.5
VCC_RC1  (via drill 0.35)
  Top 0.152: v17.5,25.6 18.07,26.17 R11.2 20.2,27.2 20.2,29.3 19.2,30.3 17.7,30.3 17.5,30.1 17.5,29.8 16.9,29.2 v16.1,29.2 | v22.4,24.8 23.38,25.77 R18.2
  Bottom 0.152: v17.5,25.6 18.3,25.6 19,24.9 21.5,24.9 21.7,24.7 22.3,24.7 v22.4,24.8 | T6.5 19.57,32.77 19.1,32.3 | 19.1,32.3 17.6,32.3 16.92,32.98 C24.2 | C18.2 14.3,38.12 | 14.3,38.12 U11.6 | 13.78,38.12 12.4,39.5 12.4,50.9 16.6,55.1 27.41,55.1 IC5.5 33.17,62.08 C15.2 | 13.78,38.12 14.3,38.12 | U10.6 14.2,33.45 | 14.2,33.45 12.95,33.45 11.9,34.5 11.9,36.4 13.62,38.12 13.78,38.12 | 19.1,32.3 18.7,31.9 18.7,30.6 18,29.9 16.8,29.9 v16.1,29.2 16.1,29.3 14.53,30.88 C23.2 14.2,32.34 14.2,33.45

### Text on the board
tPlace: 3 | 2 | 1 | ST | TH | D | #612 | J | Rev 2.0.17 | ICSP | RC | Jetson
bPlace: Designed in Aizu | Rev 2.0.17 | F-612-2-17-A-N-J-1-P
Document: #612 JetRacer Rev 2.0.17 / 2022/02/20